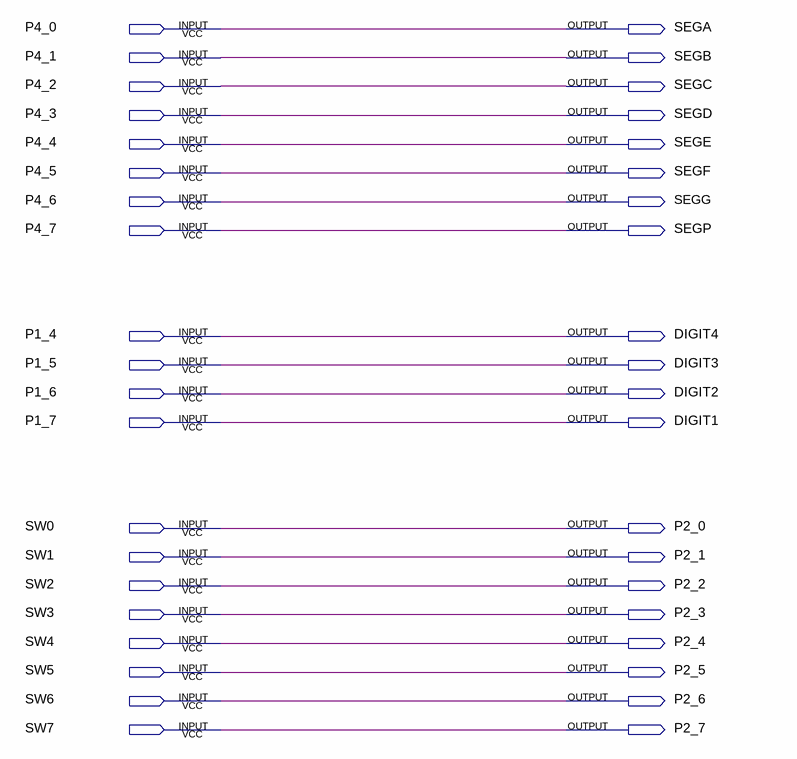
[diagram p0: schematic sheet]
// Quartus schematic ece315_top.bdf as structural Verilog: 0 symbols, 40 pins
module ece315_top (
  input  P4_0,
  input  P4_1,
  input  P4_2,
  input  P4_3,
  input  P4_4,
  input  P4_5,
  input  P4_6,
  input  P4_7,
  input  P1_4,
  input  P1_5,
  input  P1_6,
  input  P1_7,
  input  SW0,
  input  SW1,
  input  SW2,
  input  SW3,
  input  SW4,
  input  SW5,
  input  SW6,
  input  SW7,
  output SEGA,
  output SEGB,
  output SEGC,
  output SEGD,
  output SEGE,
  output SEGF,
  output SEGG,
  output SEGP,
  output DIGIT4,
  output DIGIT3,
  output DIGIT2,
  output DIGIT1,
  output P2_0,
  output P2_1,
  output P2_2,
  output P2_3,
  output P2_4,
  output P2_5,
  output P2_6,
  output P2_7
);


  assign DIGIT1 = P1_7;
  assign DIGIT2 = P1_6;
  assign DIGIT3 = P1_5;
  assign DIGIT4 = P1_4;
  assign P2_0 = SW0;
  assign P2_1 = SW1;
  assign P2_2 = SW2;
  assign P2_3 = SW3;
  assign P2_4 = SW4;
  assign P2_5 = SW5;
  assign P2_6 = SW6;
  assign P2_7 = SW7;
  assign SEGA = P4_0;
  assign SEGB = P4_1;
  assign SEGC = P4_2;
  assign SEGD = P4_3;
  assign SEGE = P4_4;
  assign SEGF = P4_5;
  assign SEGG = P4_6;
  assign SEGP = P4_7;
endmodule
